# EAGLE design SimpleTimerPCB (EAGLE 6.5.0)
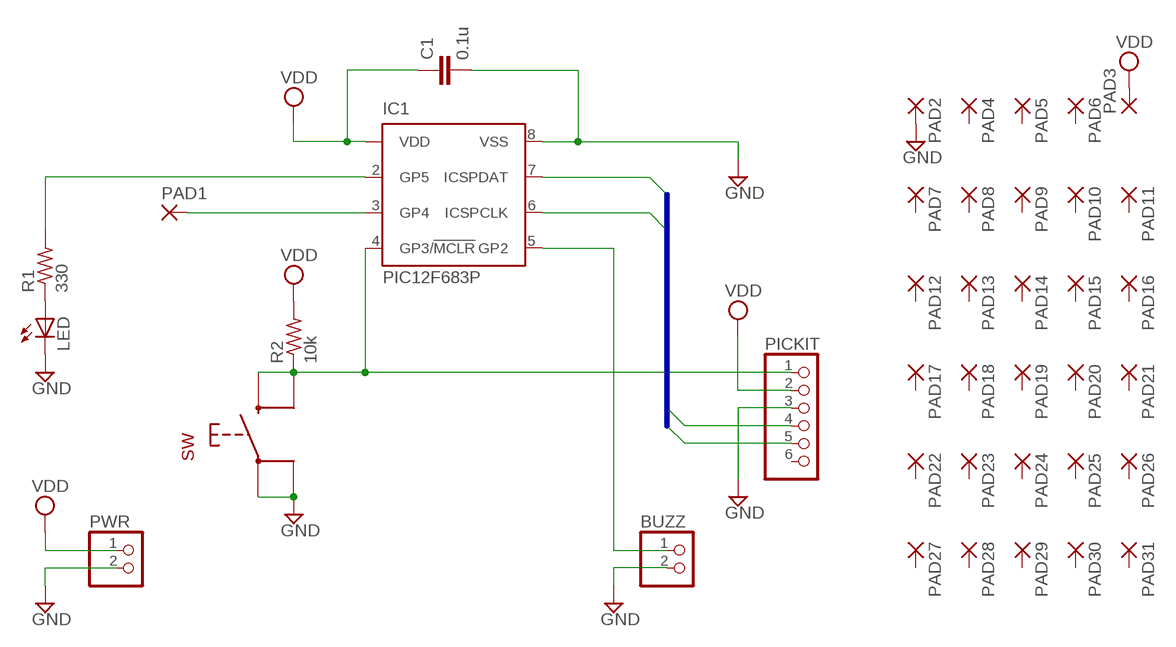
[diagram p0: schematic, sheet 1]

## Parts
BUZZ  PINHD-1X2  [1X02]
C1  0.1u  C-EU050-024X044  [C050-024X044]
IC1  PIC12F683P  [DIL8]
LED  LED3MM  [LED3MM]
PAD1  1,6/0,9  [1,6/0,9]
PAD2  1,6/0,9  [1,6/0,9]
PAD3  1,6/0,9  [1,6/0,9]
PAD4  1,6/0,9  [1,6/0,9]
PAD5  1,6/0,9  [1,6/0,9]
PAD6  1,6/0,9  [1,6/0,9]
PAD7  1,6/0,9  [1,6/0,9]
PAD8  1,6/0,9  [1,6/0,9]
PAD9  1,6/0,9  [1,6/0,9]
PAD10  1,6/0,9  [1,6/0,9]
PAD11  1,6/0,9  [1,6/0,9]
PAD12  1,6/0,9  [1,6/0,9]
PAD13  1,6/0,9  [1,6/0,9]
PAD14  1,6/0,9  [1,6/0,9]
PAD15  1,6/0,9  [1,6/0,9]
PAD16  1,6/0,9  [1,6/0,9]
PAD17  1,6/0,9  [1,6/0,9]
PAD18  1,6/0,9  [1,6/0,9]
PAD19  1,6/0,9  [1,6/0,9]
PAD20  1,6/0,9  [1,6/0,9]
PAD21  1,6/0,9  [1,6/0,9]
PAD22  1,6/0,9  [1,6/0,9]
PAD23  1,6/0,9  [1,6/0,9]
PAD24  1,6/0,9  [1,6/0,9]
PAD25  1,6/0,9  [1,6/0,9]
PAD26  1,6/0,9  [1,6/0,9]
PAD27  1,6/0,9  [1,6/0,9]
PAD28  1,6/0,9  [1,6/0,9]
PAD29  1,6/0,9  [1,6/0,9]
PAD30  1,6/0,9  [1,6/0,9]
PAD31  1,6/0,9  [1,6/0,9]
PICKIT  PINHD-1X6  [1X06]
PWR  PINHD-1X2  [1X02]
R1  330  R-US_0204/7  [0204/7]
R2  10k  R-US_0204/7  [0204/7]
SW  TACT-SWITCH  [TACTSW-25X20]

## Nets
GND [Power]: BUZZ.2 C1.2 IC1.8(VSS) LED.K(C) PAD2.1(P) PICKIT.3 PWR.2 SW.3(P1) SW.4(P2)
N$1: LED.A R1.1
N$2: IC1.4(GP3/!MCLR!) PICKIT.1 R2.1 SW.1(S1) SW.2(S2)
N$3: IC1.3(GP4) PAD1.1(P)
N$4: IC1.2(GP5) R1.2
N$6: BUZZ.1 IC1.5(GP2)
PIN4: IC1.7(ICSPDAT) PICKIT.4
PIN5: IC1.6(ICSPCLK) PICKIT.5
VDD [Power]: C1.1 IC1.1(VDD) PAD3.1(P) PICKIT.2 PWR.1 R2.2
Unconnected: PAD4.1(P) PAD5.1(P) PAD6.1(P) PAD7.1(P) PAD8.1(P) PAD9.1(P) PAD10.1(P) PAD11.1(P) PAD12.1(P) PAD13.1(P) PAD14.1(P) PAD15.1(P) PAD16.1(P) PAD17.1(P) PAD18.1(P) PAD19.1(P) PAD20.1(P) PAD21.1(P) PAD22.1(P) PAD23.1(P) PAD24.1(P) PAD25.1(P) PAD26.1(P) PAD27.1(P) PAD28.1(P) PAD29.1(P) PAD30.1(P) PAD31.1(P) PICKIT.6

## Buses
PIN[4..5]

## Library data of the parts
BUZZ PWR = pinhead:PINHD-1X2: PIN HEADER
C1 = rcl:C-EU: CAPACITOR, European symbol
IC1 = MyParts:PIC12F683: 8-Pin Flash-Based, 8-Bit CMOS Microcontrollers with nanoWatt Technology Source: http://ww1.microchip.com/downloads/en/DeviceDoc/41211D_.pdf; MF: MICROCHIP; MPN: PIC12F683-I/P; OC_FARNELL: 9759034; OC_NEWARK: 89H0442
LED = led:LED: LED OSRAM: - CHIPLED LG R971, LG N971, LY N971, LG Q971, LY Q971, LO R971, LY R971 LH N974, LH R974 LS Q976, LO Q976, LY Q976 LO Q996 - Hyper CHIPLED LW Q18S LB Q993, LB Q99A, LB R99A - SideLED LS A670, LO A670, LY A670, LG A670, LP A670 LB A673, LV A673, LT A673, LW A673 LH A674 LY A675 LS A676, LA A676, LO A676, LY A676, LW A676 LS A679, LY A679, LG A679 - Hyper Micro SIDELED® LS Y876, LA Y876, LO Y876, LY Y876 LT Y87S - SmartLED LW L88C, LW L88S LB L89C, LB L89S, LG L890 LS L89K, LO L89K, LY L89K LS L896, LA L896, LO L896, LY L896 - TOPLED LS T670, LO T670, LY T670, LG T670, LP T670 LSG T670, LSP T670, LSY T670, LOP T670, LYG T670 LG T671, LOG T671, LSG T671 LB T673, LV T673, LT T673, LW T673 LH T674 LS T676, LA T676, LO T676, LY T676, LB T676, LH T676, LSB T676, LW T676 LB T67C, LV T67C, LT T67C, LS T67K, LO T67K, LY T67K, LW E67C LS E67B, LA E67B, LO E67B, LY E67B, LB E67C, LV E67C, LT E67C LW T67C LS T679, LY T679, LG T679 LS T770, LO T770, LY T770, LG T770, LP T770 LB T773, LV T773, LT T773, LW T773 LH T774 LS E675, LA E675, LY E675, LS T675 LS T776, LA T776, LO T776, LY T776, LB T776 LHGB T686 LT T68C, LB T68C - Hyper Mini TOPLED® LB M676 - Mini TOPLED Santana® LG M470 LS M47K, LO M47K, LY M47K Source: http://www.osram.convergy.de LUXEON: - LUMILED® LXK2-PW12-R00, LXK2-PW12-S00, LXK2-PW14-U00, LXK2-PW14-V00 LXK2-PM12-R00, LXK2-PM12-S00, LXK2-PM14-U00 LXK2-PE12-Q00, LXK2-PE12-R00, LXK2-PE12-S00, LXK2-PE14-T00, LXK2-PE14-U00 LXK2-PB12-K00, LXK2-PB12-L00, LXK2-PB12-M00, LXK2-PB14-N00, LXK2-PB14-P00, LXK2-PB14-Q00 LXK2-PR12-L00, LXK2-PR12-M00, LXK2-PR14-Q00, LXK2-PR14-R00 LXK2-PD12-Q00, LXK2-PD12-R00, LXK2-PD12-S00 LXK2-PH12-R00, LXK2-PH12-S00 LXK2-PL12-P00, LXK2-PL12-Q00, LXK2-PL12-R00 Source: www.luxeon.com KINGBRIGHT: KA-3528ASYC Source: www.kingbright.com
PAD1-PAD31 = MyParts:1,6/0,9: THROUGH-HOLE PAD
PICKIT = MyParts:PINHD-1X6: PIN HEADER
R1 R2 = rcl:R-US_: RESISTOR, American symbol
SW = MyParts:TACT-SWITCH: TACTICL SWITCH Tactible Switch; AKIZUKI-OC: P-03651

## Net classes
0 default: width 0.61 mm, clearance 0.508 mm
1 Power: width 0.914 mm, clearance 0.508 mm

## Board
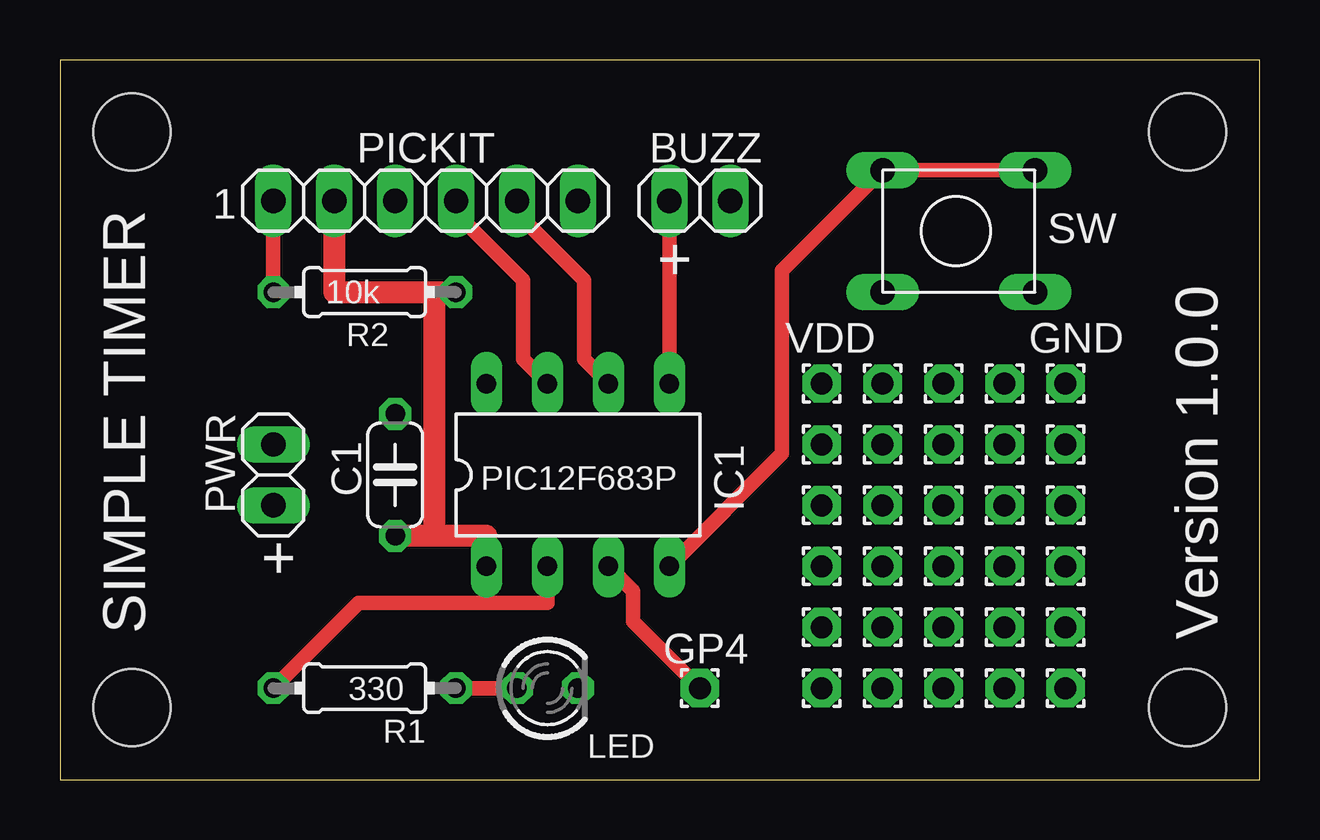
[diagram p1: board, top side]
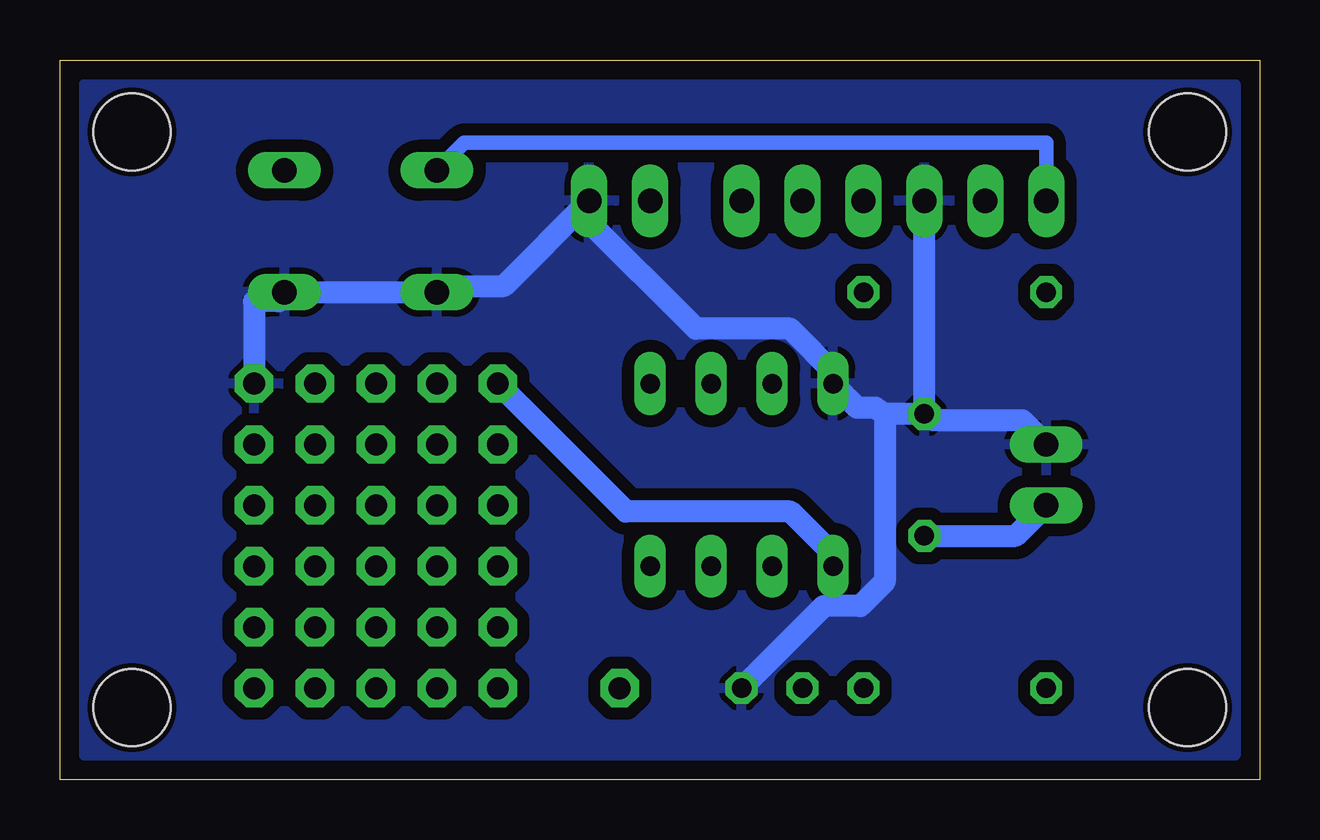
[diagram p2: board, bottom side, seen from below]

Size 50 x 30 mm. Coordinates in mm from the lower left corner, seen from the top.
Outline: 0,0 50,0 50,30 0,30 0,0
Copper layers (1*16): Top 0.035mm / dielectric 1.5mm / Bottom 0.035mm
Design rules "Elecrow_2-layer_eagle_rule": minimum track width 6mil, minimum drill 12mil, track to track 6mil, track to pad 6mil, pad to pad 6mil, via to via 6mil, smd to smd 0mil, copper to edge 10mil, drill to drill 10mil, minimum pad ring 10mil, minimum via ring 6mil, stop-mask expansion 2mil, vias tented up to drill 100mil, thermal gap 10mil
Holes 3.2 mm at 3,27 3,3 47,3 47,27

### Footprints (pad centres in the part's own frame; a part is rotated, then mirrored left to right if it is on the bottom)
1X02 = drill 1.016 long: 1 -1.27,0; 2 1.27,0
C050-024X044 = drill 0.813 octagon: 1 -2.54,0; 2 2.54,0
DIL8 = drill 0.813 long: 1 -3.81,-3.81; 2 -1.27,-3.81; 3 1.27,-3.81; 4 3.81,-3.81; 5 3.81,3.81; 6 1.27,3.81; 7 -1.27,3.81; 8 -3.81,3.81
LED3MM = drill 0.813 octagon: A -1.27,0; K 1.27,0
1,6/0,9 = drill 0.914 pad 1.6 octagon: 1 0,0
1X06 = drill 1.016 long: 1 -6.35,0; 2 -3.81,0; 3 -1.27,0; 4 1.27,0; 5 3.81,0; 6 6.35,0
0204/7 = drill 0.813 octagon: 1 -3.81,0; 2 3.81,0
TACTSW-25X20 = drill 1.016 long: 1 -2.54,2.54; 2 3.81,2.54; 3 -2.54,-2.54; 4 3.81,-2.54

### Placement (x,y rotation side)
BUZZ  26.67,24.13 0 top
C1  13.97,12.7 90 top
IC1  21.59,12.7 0 top
LED  20.32,3.81 0 top
PAD1  26.67,3.81 0 top
PAD2  41.91,16.51 0 top
PAD3  31.75,16.51 0 top
PAD4  31.75,3.81 0 top
PAD5  34.29,16.51 0 top
PAD6  36.83,16.51 0 top
PAD7  39.37,16.51 0 top
PAD8  34.29,3.81 0 top
PAD9  31.75,13.97 0 top
PAD10  34.29,13.97 0 top
PAD11  36.83,13.97 0 top
PAD12  39.37,13.97 0 top
PAD13  41.91,13.97 0 top
PAD14  36.83,3.81 0 top
PAD15  31.75,11.43 0 top
PAD16  34.29,11.43 0 top
PAD17  36.83,11.43 0 top
PAD18  39.37,11.43 0 top
PAD19  41.91,11.43 0 top
PAD20  39.37,3.81 0 top
PAD21  31.75,8.89 0 top
PAD22  34.29,8.89 0 top
PAD23  36.83,8.89 0 top
PAD24  39.37,8.89 0 top
PAD25  41.91,8.89 0 top
PAD26  41.91,3.81 0 top
PAD27  31.75,6.35 0 top
PAD28  34.29,6.35 0 top
PAD29  36.83,6.35 0 top
PAD30  39.37,6.35 0 top
PAD31  41.91,6.35 0 top
PICKIT  15.24,24.13 0 top
PWR  8.89,12.7 90 top
R1  12.7,3.81 180 top
R2  12.7,20.32 0 top
SW  36.83,22.86 0 top

### Tracks (layer width: path | path; a pad name or v marks a point on that pad's centre or on a via)
GND
  Bottom 0.914: PAD2.1 41.91,19.94 40.89,19.94 SW.4 SW.3 33.91,20.57 31.5,20.57 BUZZ.2 28.07,23.37 23.5,18.8 19.56,18.8 17.65,16.89 IC1.8 16.76,15.49 16,15.49 15.62,15.24 | LED.K 18.16,7.24 16.64,7.24 15.62,8.26 15.62,15.24 | C1.2 15.62,15.24 | PWR.2 9.91,14.99 13.59,14.99 C1.2 | C1.2 PICKIT.3
  pour Bottom: 1,29 1,1 49,1 49,29
N$1
  Top 0.61: LED.A R1.1
N$2
  Top 0.61: PICKIT.1 R2.1 | IC1.4 30.1,13.59 30.1,21.21 SW.1 SW.2
  Bottom 0.61: PICKIT.1 8.89,26.54 33.15,26.54 SW.1
N$3
  Top 0.61: IC1.3 23.88,7.87 23.88,6.6 PAD1.1
N$4
  Top 0.61: R1.2 12.45,7.37 20.32,7.37 IC1.2
N$6
  Top 0.61: BUZZ.1 IC1.5
PIN4
  Top 0.61: IC1.7 19.3,17.53 19.3,20.83 16.51,23.62 PICKIT.4
PIN5
  Top 0.61: IC1.6 21.84,17.53 21.84,20.83 19.05,23.62 PICKIT.5
VDD
  Top 0.914: 15.62,20.32 11.43,20.32 PICKIT.2 | 15.62,20.32 R2.2 | 15.62,10.16 17.78,10.16 IC1.1 | 15.62,10.16 C1.1 | 15.62,10.16 15.62,20.32
  Bottom 0.914: PWR.1 10.16,10.16 C1.1 | PAD3.1 26.42,11.18 19.56,11.18 17.78,9.4 IC1.1

### Text on the board
tNames: 1 | + | VDD | GND | + | SIMPLE TIMER | Version 1.0.0 | GP4